# Altium project MK2_PD.PrjPcb
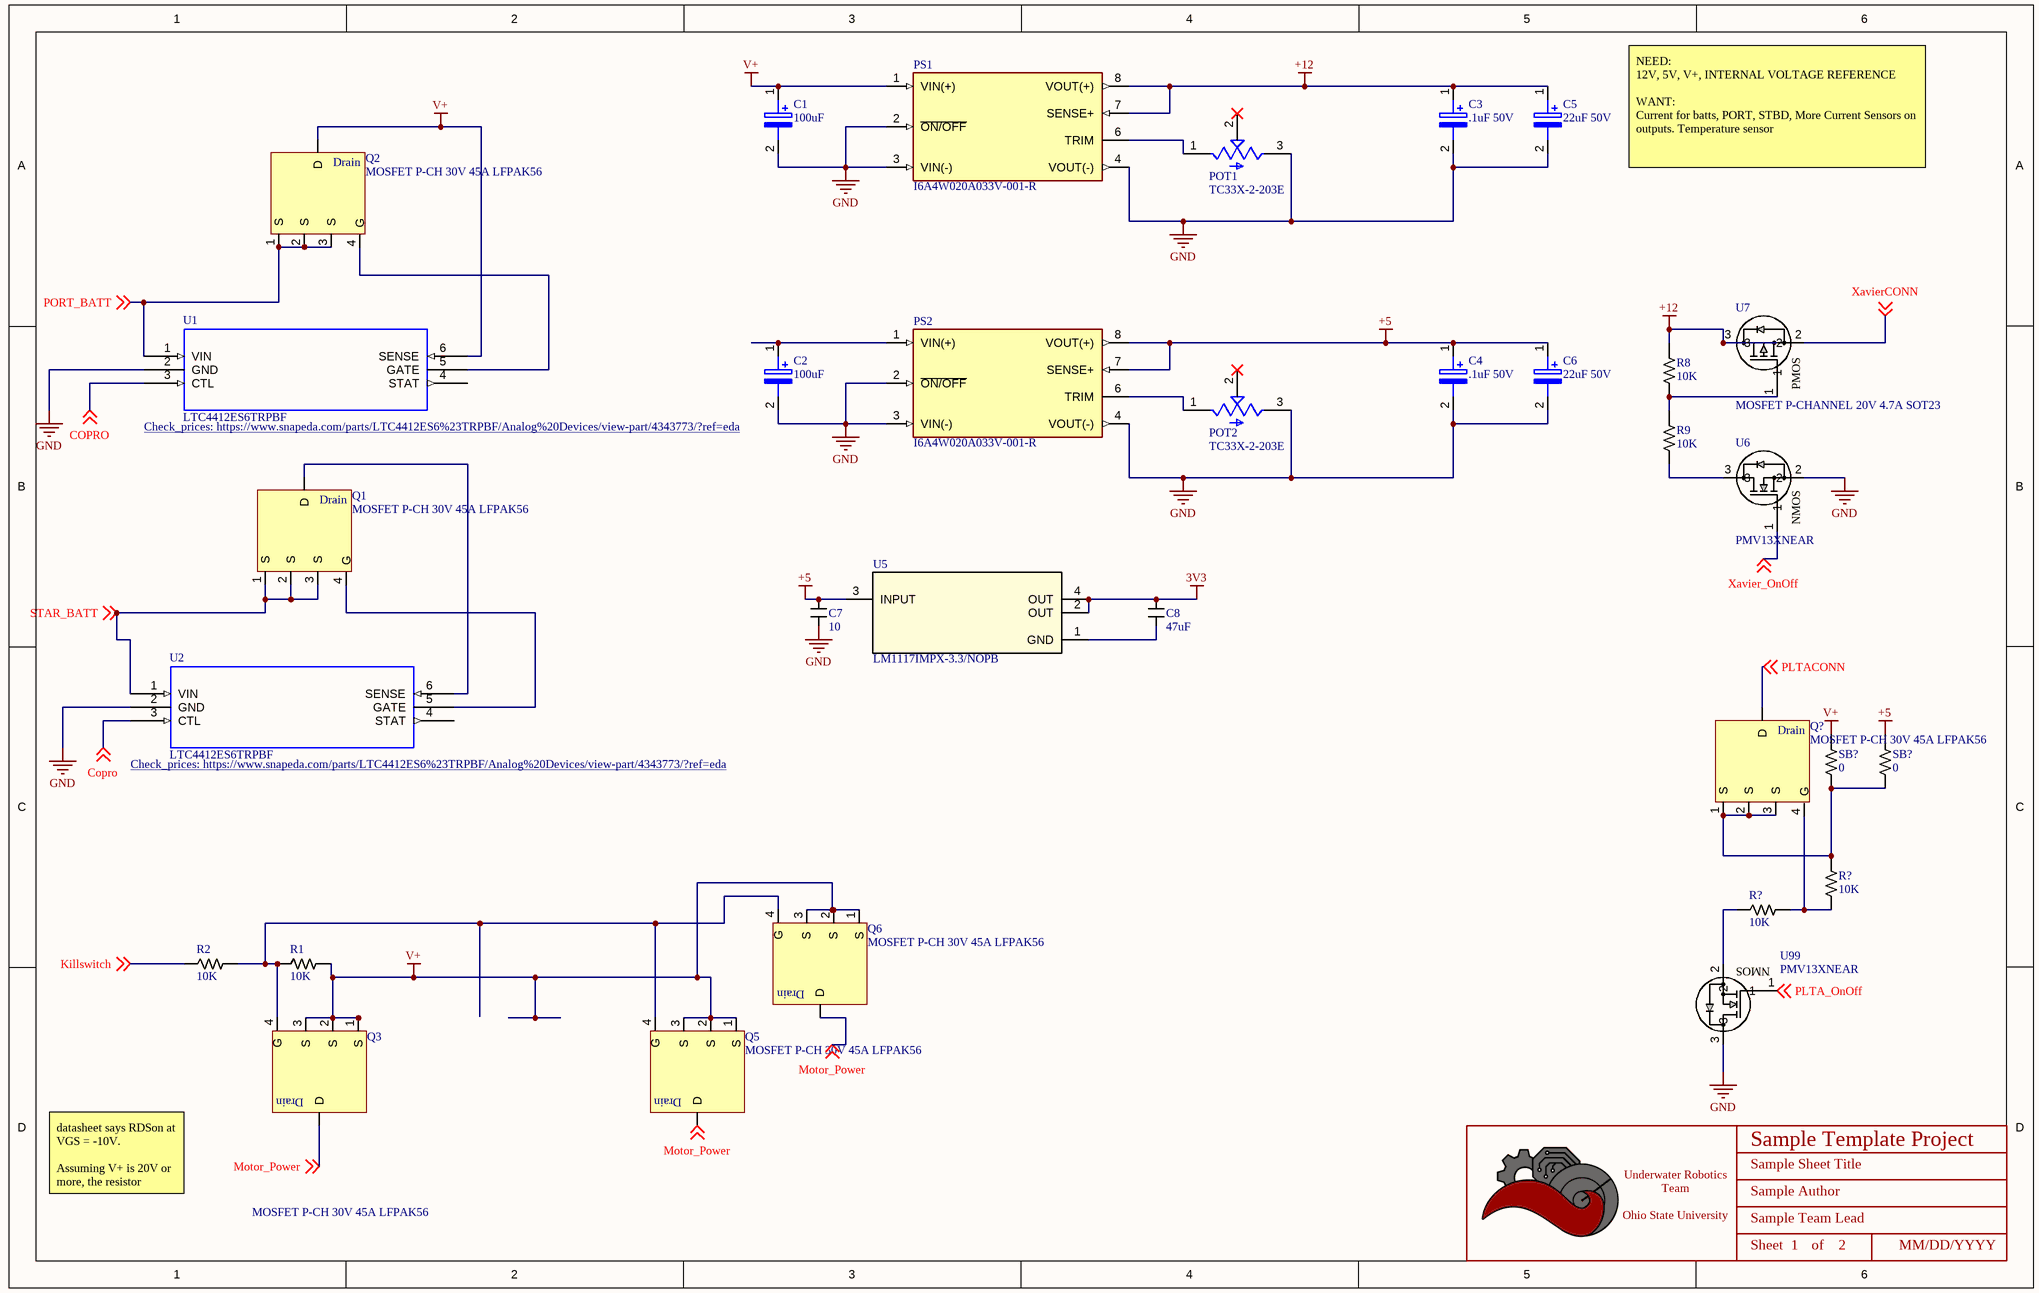
[diagram p0: PD_MK2.SchDoc]
BoardRevision: 1.0; DateOfDesignReview: XX/XX/XXXX; ProjectTitle: Sample Template Project; TeamLead: Sample Team Lead
1 sheet, 33 parts. Net scope: global (net labels, ports and power ports of the same name join across sheets).
Board file: Pcb_4layer_8x4_Template.PcbDoc

## Sheet PD_MK2.SchDoc: Sample Sheet Title
size B; Date: MM/DD/YYYY; Author: Sample Author; Organization: ORGANIZATION; Address1: ADDRESS 1; Address2: ADDRESS 2; Address3: ADDRESS 3; Address4: ADDRESS 4; Revision: -; SheetNumber: 1; SheetTotal: 2; ENG_APP_DATE: --/--/--; DSN_APP_DATE: --/--/--; CHK_APP_DATE: --/--/--

### Parts
(Parts that share a designator on the sheet are numbered #1, #2 ... from top to bottom, then left to right.)
*  Title_Block  [LOGO]  (value not drawn)  (graphical)
C1  100uF  [CAPAE430X550N]
C2  100uF  [CAPAE430X550N]
C3  .1uF 50V  [CAPAE430X550N]
C4  .1uF 50V  [CAPAE430X550N]
C5  22uF 50V  [CAPAE430X550N]
C6  22uF 50V  [CAPAE430X550N]
C7  Value (uF): 10  [CAPACITOR_0603]  (hidden comment: 10uF Ceramic 6.3V)
C8  value 47uF  [CAPACITOR_0603]  (hidden comment: 47uF Ceramic 6.3V)
POT1  TC33X-2-203E  [TRIM_TC33X-2-203E]
POT2  TC33X-2-203E  [TRIM_TC33X-2-203E]
PS1  I6A4W020A033V-001-R  [CONV_I6A4W020A033V-001-R]
PS2  I6A4W020A033V-001-R  [CONV_I6A4W020A033V-001-R]
Q1  MOSFET P-CH 30V 45A LFPAK56  [TRANS_PSMN5R5-60YS,115]
Q2  MOSFET P-CH 30V 45A LFPAK56  [TRANS_PSMN5R5-60YS,115]
Q3  MOSFET P-CH 30V 45A LFPAK56  [TRANS_PSMN5R5-60YS,115]
Q5  MOSFET P-CH 30V 45A LFPAK56  [TRANS_PSMN5R5-60YS,115]
Q6  MOSFET P-CH 30V 45A LFPAK56  [TRANS_PSMN5R5-60YS,115]
Q?  MOSFET P-CH 30V 45A LFPAK56  [TRANS_PSMN5R5-60YS,115]
R1  Value  (Ohms): 10K  [RESISTOR_0603]  (hidden comment: 10k Ohm 5% 1/10W)
R2  Value  (Ohms): 10K  [RESISTOR_0603]  (hidden comment: 10k Ohm 5% 1/10W)
R8  Value  (Ohms): 10K  [RESISTOR_0603]  (hidden comment: 10k Ohm 5% 1/10W)
R9  Value  (Ohms): 10K  [RESISTOR_0603]  (hidden comment: 10k Ohm 5% 1/10W)
R?#1  Value  (Ohms): 10K  [RESISTOR_0603]  (hidden comment: 10k Ohm 5% 1/10W)
R?#2  Value  (Ohms): 10K  [RESISTOR_0603]  (hidden comment: 10k Ohm 5% 1/10W)
SB?#1  Value  (Ohms): 0  [RESISTOR_0603]  (hidden comment: 0 Ohm Jumper No Fit)
SB?#2  Value  (Ohms): 0  [RESISTOR_0603]  (hidden comment: 0 Ohm Jumper No Fit)
U1  LTC4412ES6TRPBF  [TSOT-23_S6]
U2  LTC4412ES6TRPBF  [TSOT-23_S6]
U5  LM1117IMPX-3.3/NOPB  [SOT-223-4]
U6  PMV13XNEAR  [SOT-23-3]
U7  MOSFET P-CHANNEL 20V 4.7A SOT23  [SOT-23-3]
U99  PMV13XNEAR  [SOT-23-3]

### Nets
3V3: C8.1 U5.2(OUT) U5.4(OUT)
+5: C4.1(POS) C6.1(POS) C7.1 PS2.7(SENSE+) PS2.8(VOUT(+)) SB?#2.1 U5.3(INPUT)
+12: C3.1(POS) C5.1(POS) PS1.7(SENSE+) PS1.8(VOUT(+)) R8.1 U7.3
GND: C1.2(NEG) C2.2(NEG) C3.2(NEG) C4.2(NEG) C5.2(NEG) C6.2(NEG) C7.2 POT1.3(CW) POT2.3(CW) PS1.2(~{ON/OFF}) PS1.3(VIN(-)) PS1.4(VOUT(-)) PS2.2(~{ON/OFF}) PS2.3(VIN(-)) PS2.4(VOUT(-)) U1.2(GND) U2.2(GND) U6.2 U99.3
V+: C1.1(POS) PS1.1(VIN(+)) Q2.5(D) Q3.1(S) Q3.2(S) Q3.3(S) Q5.1(S) Q5.2(S) Q5.3(S) Q6.1(S) Q6.2(S) Q6.3(S) R1.1 SB?#1.1 U1.6(SENSE)
COPRO: U1.3(CTL) U2.3(CTL) ; off-sheet COPRO, off-sheet Copro
Killswitch: R2.2 ; off-sheet Killswitch
Motor_Power: Q3.5(D) Q5.5(D) Q6.5(D) ; off-sheet Motor_Power
PLTA_OnOff: U99.1 ; off-sheet PLTA_OnOff
PLTACONN: Q?.5(D) ; off-sheet PLTACONN
PORT_BATT: Q2.1(S) Q2.2(S) Q2.3(S) U1.1(VIN) ; off-sheet PORT_BATT
STAR_BATT: Q1.1(S) Q1.2(S) Q1.3(S) U2.1(VIN) ; off-sheet STAR_BATT
Xavier_OnOff: U6.1 ; off-sheet Xavier_OnOff
XavierCONN: U7.2 ; off-sheet XavierCONN
NetC2_1: C2.1(POS) PS2.1(VIN(+))
NetC8_2: C8.2 U5.1(GND)
NetPOT1_1: POT1.1(CCW) PS1.6(TRIM)
NetPOT2_1: POT2.1(CCW) PS2.6(TRIM)
NetQ1_4: Q1.4(G) U2.5(GATE)
NetQ1_5: Q1.5(D) U2.6(SENSE)
NetQ2_4: Q2.4(G) U1.5(GATE)
NetQ3_4: Q3.4(G) Q5.4(G) Q6.4(G) R1.2 R2.1
NetQ?_1: Q?.1(S) Q?.2(S) Q?.3(S) R?#1.1 SB?#1.2 SB?#2.2
NetQ?_4: Q?.4(G) R?#1.2 R?#2.1
NetR8_2: R8.2 R9.1 U7.1
NetR9_2: R9.2 U6.3
NetR?#2_2: R?#2.2 U99.2

Not connected (* = marked no-connect by the designer): POT1 2(W)*; POT2 2(W)*; U1 4(STAT); U2 4(STAT)

### Notes on the sheet
- NEED:
  12V, 5V, V+, INTERNAL VOLTAGE REFERENCE
  WANT:
  Current for batts, PORT, STBD, More Current Sensors on outputs. Temperature sensor
- datasheet says RDSon at VGS = -10V.
  Assuming V+ is 20V or more, the resistor divider will make Vg 10 V which would mean VGS is -10V
- DWG. NO.
- REV.
- SHT.
- THIS DOCUMENT AND THE DATA DISCLOSED HEREIN OR HEREWITH IS THE PROPERTY OF ALTIUM LIMITED AND MAY BE FREELY DISTRIBUTED IN WHOLE. NO RIGHTS ARE RESERVED OR EXPRESS OR IMPLIED WARANTEE GIVEN.
- REVISION
- DESCRIPTION
- DATE
- APPROVED
- ENG:
- APPROVALS
- PROJECT
- DSN:
- CHK:
- REFERENCE DOCUMENTS
- PROJECT REVISION:
- TITLE
- DOCUMENT REVISION:
- DESIGN ITEM:
- BOM:
- FAB DWG:
- PCB DWG:
- ASSY DWG:
- SCALE:
- SIZE
- B
- CAGE CODE
- FILE NAME
- DWG NO.
- SHEET
- OF
- REV
- (in symbol BUK6Y19-30PX) Drain
- (in symbol PMV13XNEAR) NMOS
- (in symbol Title_Block) Underwater Robotics Team / Ohio State University; Sheet; of
- (in symbol TSM500P02CX) PMOS

### Library data of the parts
* = Title_Block: UWRT Schematic Title Block Template / Created June 2021, Dylan Trainor
C1-C6 = 865250340002: 4.7ÂµF 16V Aluminum Electrolytic Capacitors Radial, Can - SMD 2000 Hrs @ 85Â°C; MF: Wurth Elektronik; Value: *; SnapEDA_Link: https://www.snapeda.com/parts/865250340002/W%C3%BCrth%20Elektronik/view-part/5002976/?ref=snap; MP: 865250340002; Purchase-URL: https://pricing.snapeda.com/search/part/865250340002/?ref=eda; Check_prices: https://www.snapeda.com/parts/865250340002/W%C3%BCrth%20Elektronik/view-part/5002976/?ref=eda; Availability: Warning; Price: None; Package: None
C7 = CAPACITOR_10uF_0603: Cap 10uF 6.3V +/-20% / Ceramic 0603; Made By: Flip B; ComponentLink1Description: Digikey; ComponentLink1URL: https://www.digikey.com/en/products/detail/samsung-electro-mechanics/CL10A106MQ8NNNC/3886777; Supplier 1: Digi-Key; Supplier Part Number 1: 1276-1119-1-ND; Tolerance: +/- 20%; Voltage: 6.3V
C8 = CAPACITOR_47uF_0603: Cap 47uF 6.3V +/-20% / Ceramic 0603; Made By: Flip B; ComponentLink1Description: Datsheet; ComponentLink1URL: https://www.mouser.com/datasheet/2/212/KEM_C1002_X7R_SMD-1102033.pdf; Tolerance: +/- 20%; Voltage: 6.3V; Supplier 1: Digi-Key; Supplier Part Number 1: 490-13247-1-ND
POT1 POT2 = TC33X-2-203E: 20 kOhms 0.1W, 1/10W J Lead Surface Mount Trimmer Potentiometer Cermet 1 Turn Top Adjustment; MF: Bourns; Value: *; SnapEDA_Link: https://www.snapeda.com/parts/TC33X-2-203E/Bourns/view-part/312812/?ref=snap; Check_prices: https://www.snapeda.com/parts/TC33X-2-203E/Bourns/view-part/312812/?ref=eda; Digi-Key_Part_Number: TC33X-2-203ECT-ND; Purchase-URL: https://pricing.snapeda.com/search/part/TC33X-2-203E/?ref=eda; Package: 1608 Bourns; MP: TC33X-2-203E
PS1 PS2 = I6A4W020A033V-001-R: Non-Isolated PoL Module DC DC Converter 1 Output 3.3 ~ 15V 20A 9V - 53V Input; MF: TDK-Lambda Americas; Availability: In Stock; Price: None; Package: DIP-8 TDK-Lambda; MP: I6A4W020A033V-001-R; Value: *; SnapEDA_Link: https://www.snapeda.com/parts/I6A4W020A033V-001-R/TDK-Lambda%20Americas%20Inc./view-part/1737324/?ref=snap; Check_prices: https://www.snapeda.com/parts/I6A4W020A033V-001-R/TDK-Lambda%20Americas%20Inc./view-part/1737324/?ref=eda; Purchase-URL: https://pricing.snapeda.com/search/part/I6A4W020A033V-001-R/?ref=eda
Q1-Q3 Q5 Q6 Q? = BUK6Y19-30PX: P-Channel 30 V 45A (Ta) 66W (Ta) Surface Mount LFPAK56, Power-SO8
R1 R2 R8 R9 R?#1 R?#2 = RESISTOR_10K_0603: RES 10k OHM 5% 1/10W 0603; Tolerance: +/- 5%; Wattage: 1/8W; Made By: Robert Pafford; ComponentLink1Description: Datasheet; ComponentLink1URL: https://www.bourns.com/docs/product-datasheets/CRxxxxx.pdf; Supplier: Digikey; Digikey Part Numer: CR0603-JW-104ELFTR-ND; Supplier 1: Digi-Key; Supplier Part Number 1: 2019-RK73B1JTTD103JCT-ND
SB?#1 SB?#2 = JUMPER_0_0603: 0 Ohm Jumper No Fit for Solder Bridge; Made By: Robert Pafford; ComponentLink1Description: Digikey; ComponentLink1URL: https://www.digikey.com/en/products/detail/koa-speer-electronics-inc/RK73B1JTTD101J/9844701
U1 U2 = LTC4412ES6TRPBF: OR Controller Source Selector Switch P-Channel 2:1 TSOT-23-6; MP: LTC4412ES6#TRPBF; MF: Analog Devices; Price: None; Availability: Good; Mouser-Purchase-URL: https://snapeda.com/shop?store=Mouser&id=4343773; Arrow_Europe-Purchase-URL: https://snapeda.com/shop?store=Arrow+Europe&id=4343773; DigiKey-Purchase-URL: https://snapeda.com/shop?store=DigiKey&id=4343773; Package: SOT-23-6 Analog Devices; SnapEDA_Link: https://www.snapeda.com/parts/LTC4412ES6%23TRPBF/Analog%20Devices/view-part/4343773/?ref=snap; Value: *; Check_prices: https://www.snapeda.com/parts/LTC4412ES6%23TRPBF/Analog%20Devices/view-part/4343773/?ref=eda
U5 = LM1117IMPX-3.3/NOPB: IC REG LIN 3.3V 800MA SOT223-4; PartNumber: LM1117IMP-3.3/NOPB; Manufacturer: Texas Instruments; Vin (Max): 15V; Supplier 1: Digi-Key; Supplier Part Number 1: LM1117IMPX-3.3/NOPBCT-ND; Vout (Min/Fixed): 3.3V; Amp Out: 800mA; Package: SOT-223-4; Created By: Dylan T
U6 U99 = PMV13XNEAR: N-Channel 20 V 7.3A (Ta) 610mW (Ta), 8.3W (Tc) Surface Mount TO-236AB; Vendor: Nexperia USA Inc.; SourceLibrary: ON_Semiconductor_2020-01-13; Vgs (Max): +/- 12 V; Vgs (th): 1.3V @ 250uA; Vdss: 20 V; Rds (on): 15mOhm @ 7.3A, 8V; Amp Rating: 7.3 A; FET Type: N-Channel; Package: SOT23-3L; Manufacturer _Part_Number: PMV13XNEAR; Power Dissipation: 610mW (Ta), 8.3W (Tc); Created By: Dylan T; Supplier 1: Mouser; Supplier Part Number 1: 771-PMV13XNEAR
U7 = TSM500P02CX: P-Channel 20 V 4.7A (Tc) 1.56W (Tc) Surface Mount SOT-23; Vendor: Taiwan Semiconductor Corporation; Vgs (Max): ±10V; Vgs (th): 800mV @ 250µA; Rds (on): 50mOhm @ 3A, 4.5V; Amp Rating: 4.7 A; FET Type: P-Channel; Package: TO-236-3, SC-59, SOT-23-3; Manufacturer_Part_Number: TSM500P02CX; Vdss: 20 V; Power Dissipation: 1.56W (Tc); Created By: Robert Pafford; Supplier 1: Digi-Key; Supplier Part Number 1: TSM500P02CXRFGCT-ND